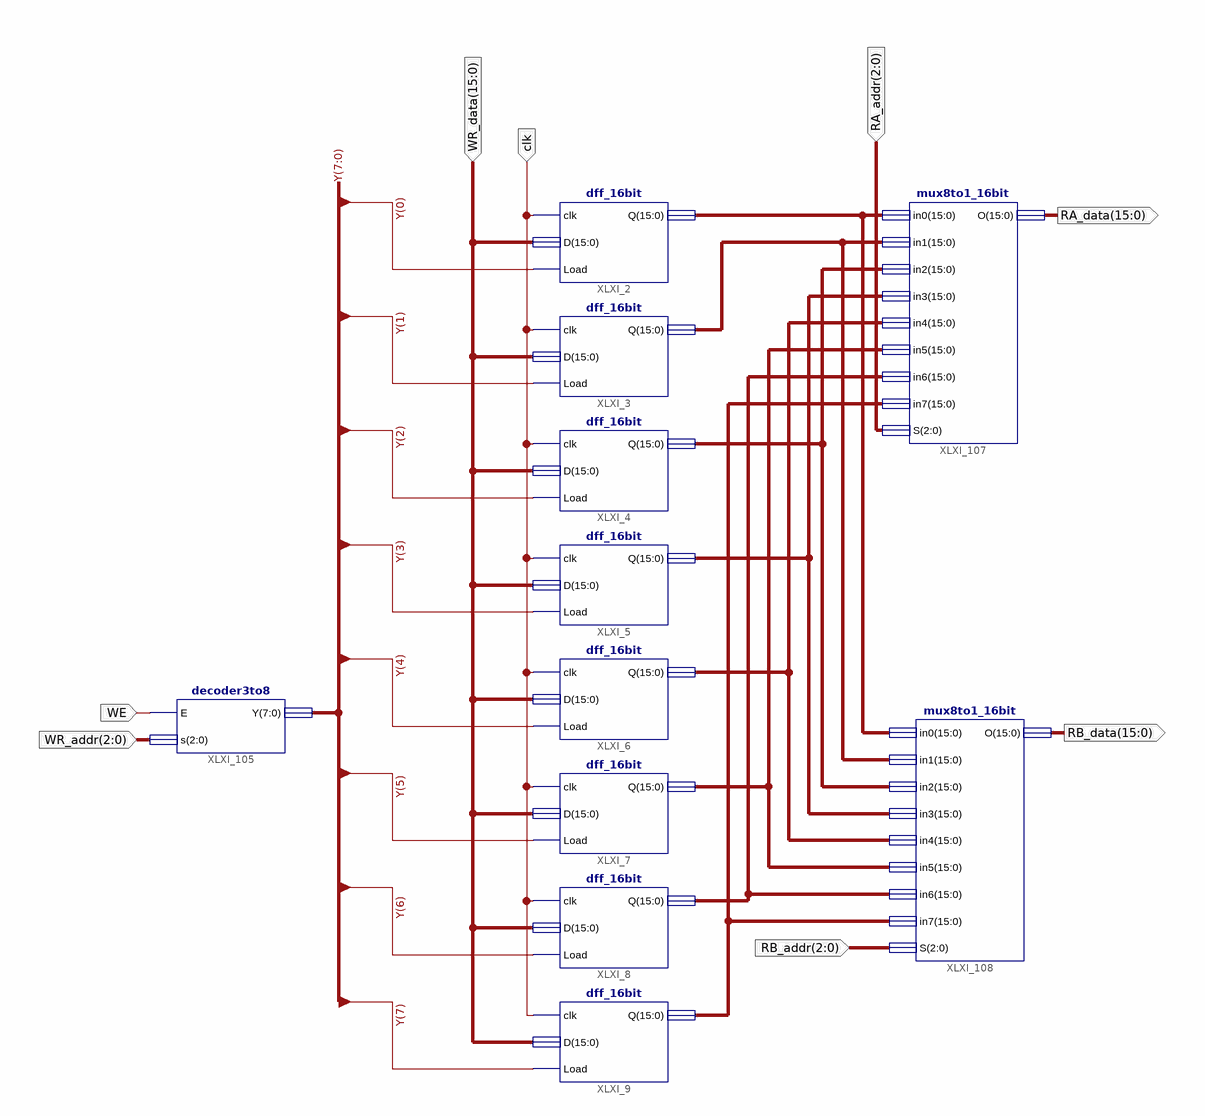
[diagram p0: schematic sheet 1]
// Xilinx ISE schematic schematic_16bitRF.sch (spartan6) as structural Verilog: 11 symbols, 8 ports
module schematic_16bitRF (
  input  [15:0] WR_data,
  input  [2:0] RA_addr,
  input  clk,
  input  WE,
  input  [2:0] WR_addr,
  input  [2:0] RB_addr,
  output [15:0] RA_data,
  output [15:0] RB_data
);

  wire [7:0] Y;
  wire [15:0] XLXN_65, XLXN_68, XLXN_69, XLXN_70, XLXN_71, XLXN_72, XLXN_73, XLXN_74;

  dff_16bit XLXI_2 (.clk(clk), .D(WR_data), .Load(Y[0]), .Q(XLXN_65));
  dff_16bit XLXI_3 (.clk(clk), .D(WR_data), .Load(Y[1]), .Q(XLXN_68));
  dff_16bit XLXI_5 (.clk(clk), .D(WR_data), .Load(Y[3]), .Q(XLXN_70));
  dff_16bit XLXI_6 (.clk(clk), .D(WR_data), .Load(Y[4]), .Q(XLXN_71));
  dff_16bit XLXI_7 (.clk(clk), .D(WR_data), .Load(Y[5]), .Q(XLXN_72));
  dff_16bit XLXI_8 (.clk(clk), .D(WR_data), .Load(Y[6]), .Q(XLXN_73));
  dff_16bit XLXI_9 (.clk(clk), .D(WR_data), .Load(Y[7]), .Q(XLXN_74));
  dff_16bit XLXI_4 (.clk(clk), .D(WR_data), .Load(Y[2]), .Q(XLXN_69));
  decoder3to8 XLXI_105 (.E(WE), .s(WR_addr), .Y(Y));
  mux8to1_16bit XLXI_107 (
    .in0(XLXN_65), .in1(XLXN_68), .in2(XLXN_69), .in3(XLXN_70), .in4(XLXN_71), .in5(XLXN_72), .in6(XLXN_73),
    .in7(XLXN_74), .S(RA_addr), .O(RA_data));
  mux8to1_16bit XLXI_108 (
    .in0(XLXN_65), .in1(XLXN_68), .in2(XLXN_69), .in3(XLXN_70), .in4(XLXN_71), .in5(XLXN_72), .in6(XLXN_73),
    .in7(XLXN_74), .S(RB_addr), .O(RB_data));
endmodule
